# EAGLE design Double Socket_NoPowersch (EAGLE 7.4.0)
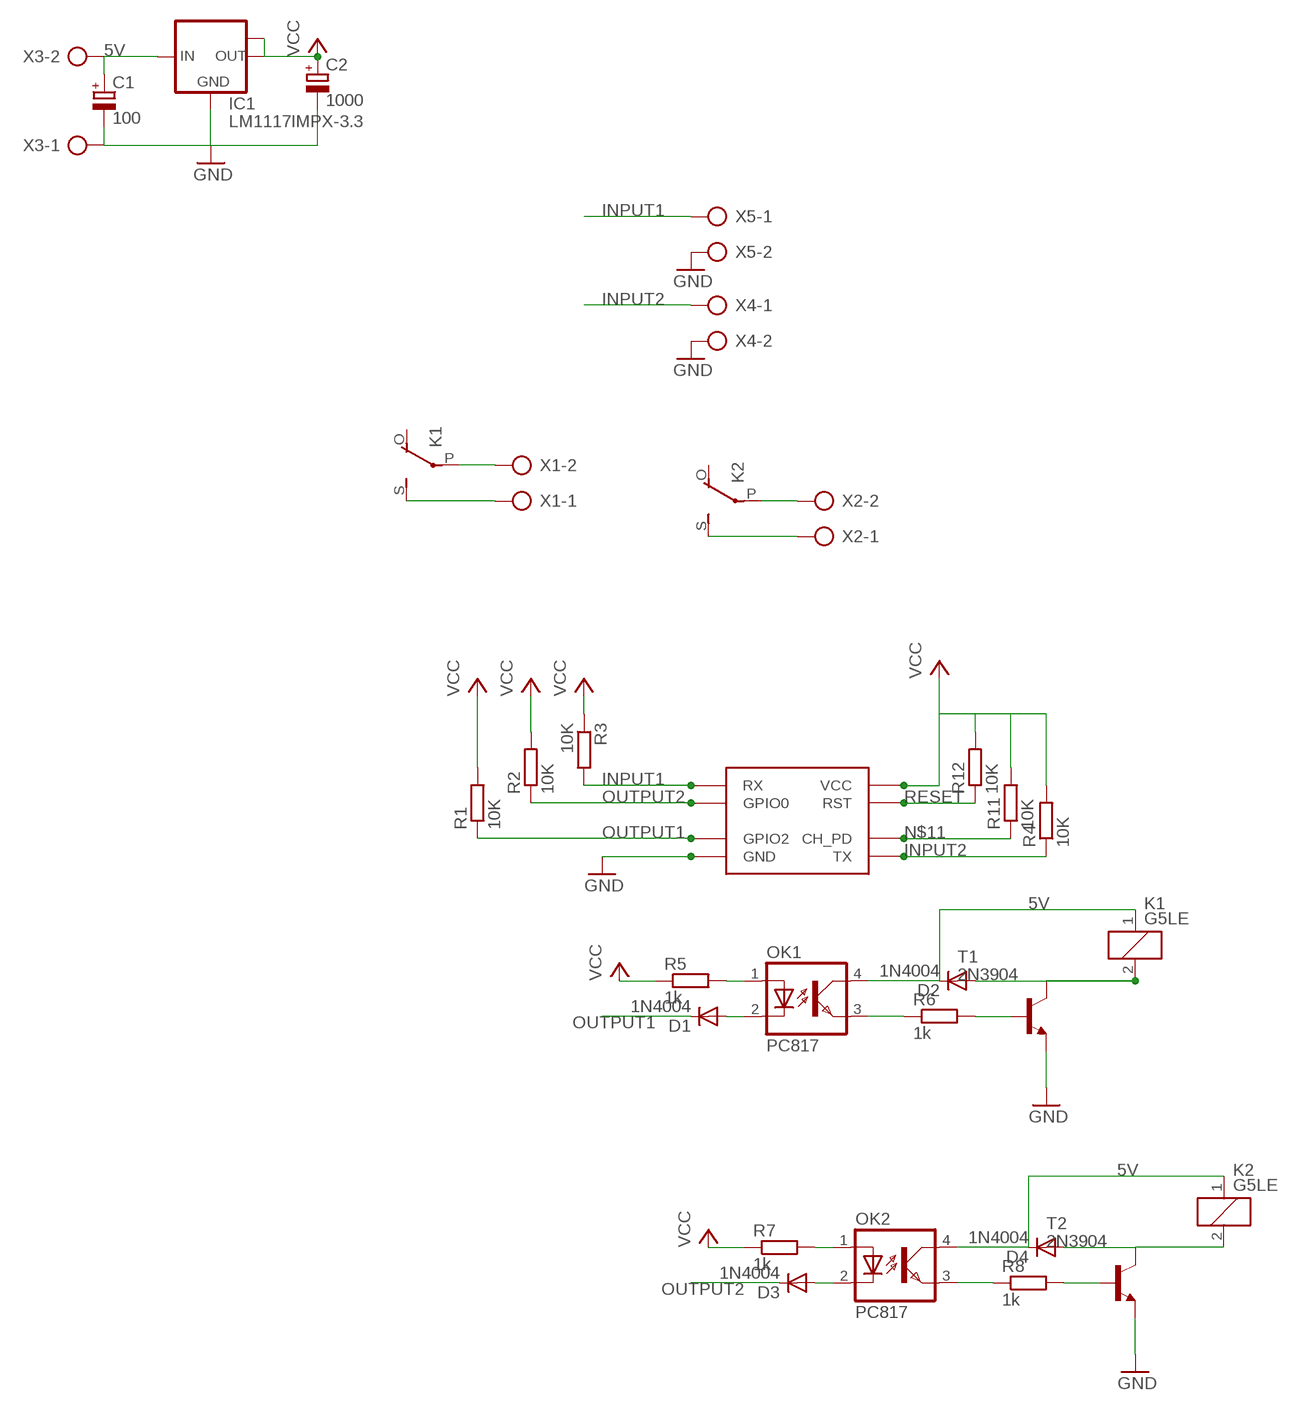
[diagram p0: schematic, sheet 1]

## Parts
C1  100  CPOL-EUE5-10.5  [E5-10,5]
C2  1000  CPOL-EUE5-10.5  [E5-10,5]
D1  1N4004  [DO41-10]
D2  1N4004  [DO41-10]
D3  1N4004  [DO41-10]
D4  1N4004  [DO41-10]
IC1  LM1117IMPX-3.3  [SOT223]
K1  G5LE  [G5LE]
K2  G5LE  [G5LE]
OK1  PC817  [DIL04]
OK2  PC817  [DIL04]
R1  10K  R-EU_0207/10  [0207/10]
R2  10K  R-EU_0207/10  [0207/10]
R3  10K  R-EU_0207/10  [0207/10]
R4  10K  R-EU_0207/10  [0207/10]
R5  1k  R-EU_0207/10  [0207/10]
R6  1k  R-EU_0207/10  [0207/10]
R7  1k  R-EU_0207/10  [0207/10]
R8  1k  R-EU_0207/10  [0207/10]
R11  10K  R-EU_0207/10  [0207/10]
R12  10K  R-EU_0207/10  [0207/10]
T1  2N3904  [TO92]
T2  2N3904  [TO92]
U$2  ESP8266  [ESP8266]
X1  AK500/2-H  [AK500/2-H]
X2  AK500/2-H  [AK500/2-H]
X3  AK500/2-H  [AK500/2-H]
X4  AK500/2-H  [AK500/2-H]
X5  AK500/2-H  [AK500/2-H]

## Nets
5V: C1.+ D2.C D4.C IC1.3(IN) K1.1 K2.1 OK1.4(COL) OK2.4(COL) X3.2
GND: C1.- C2.- IC1.1(GND) T1.3(E) T2.3(E) U$2.GND X3.1 X4.2 X5.2
INPUT1: R3.2 U$2.RX X5.1
INPUT2: R4.1 U$2.TX X4.1
N$1: K1.P(2:P) X1.2
N$2: K1.S(2:S) X1.1
N$3: OK1.1(A) R5.2
N$4: OK1.3(EMIT) R6.1
N$5: D1.A OK1.2(C)
N$6: OK2.1(A) R7.2
N$7: R6.2 T1.2(B)
N$8: D2.A K1.2 T1.1(C)
N$9: OK2.3(EMIT) R8.1
N$10: D3.A OK2.2(C)
N$11: R11.1 U$2.CH_PD
N$12: R8.2 T2.2(B)
N$13: D4.A K2.2 T2.1(C)
N$14: K2.S(2:S) X2.1
N$15: K2.P(2:P) X2.2
OUTPUT1: D1.C R1.1 U$2.GPIO2
OUTPUT2: D3.C R2.1 U$2.GPIO0
RESET: R12.1 U$2.RST
VCC: C2.+ IC1.2(OUT) IC1.TAB(OUT1) R1.2 R2.2 R3.1 R4.2 R5.1 R7.1 R11.2 R12.2 U$2.VCC
Unconnected: K1.O(2:O) K2.O(2:O)

## Library data of the parts
C1 C2 = rcl:CPOL-EU: POLARIZED CAPACITOR, European symbol
D1-D4 = diode:1N4004: DIODE general purpose rectifier, 1 A
IC1 = lm1117:LM1117IMPX-*
K1 K2 = relay:G5LE: RELAY 1 x switch, 10 A/120 V AC, 8 A/30 V DC, Omron; OC_FARNELL: unknown; OC_NEWARK: unknown
OK1 OK2 = optocoupler:PC817: SHARP OPTO COUPLER; MPN: PC817X4J000F; OC_FARNELL: 9707727; OC_NEWARK: 97K7059
R1-R8 R11 R12 = rcl:R-EU_: RESISTOR, European symbol
T1 T2 = transistor:2N3904: NPN TRANSISTOR
U$2 = Andre:ESP8266
X1-X5 = con-ptr500:AK500/2-H: CONNECTOR Aug. 2004 / PTR Meßtechnik: Die Bezeichnung der Serie AK505 wurde geändert. Es handelt sich hierbei um AK500 in horizontaler Ausführung.

## Board
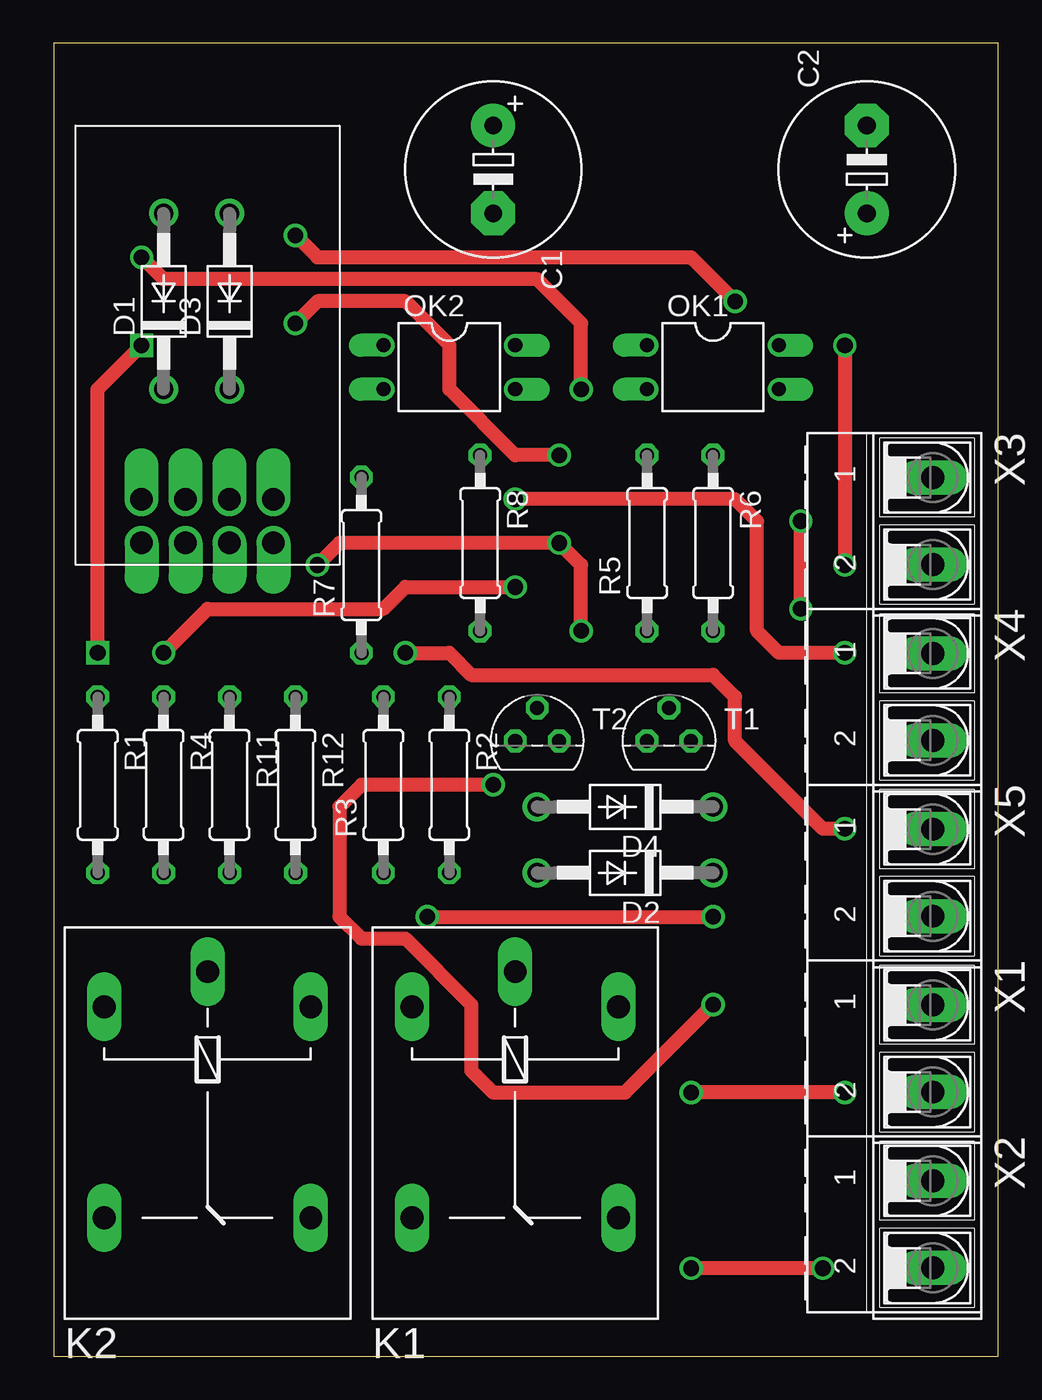
[diagram p1: board, top side]
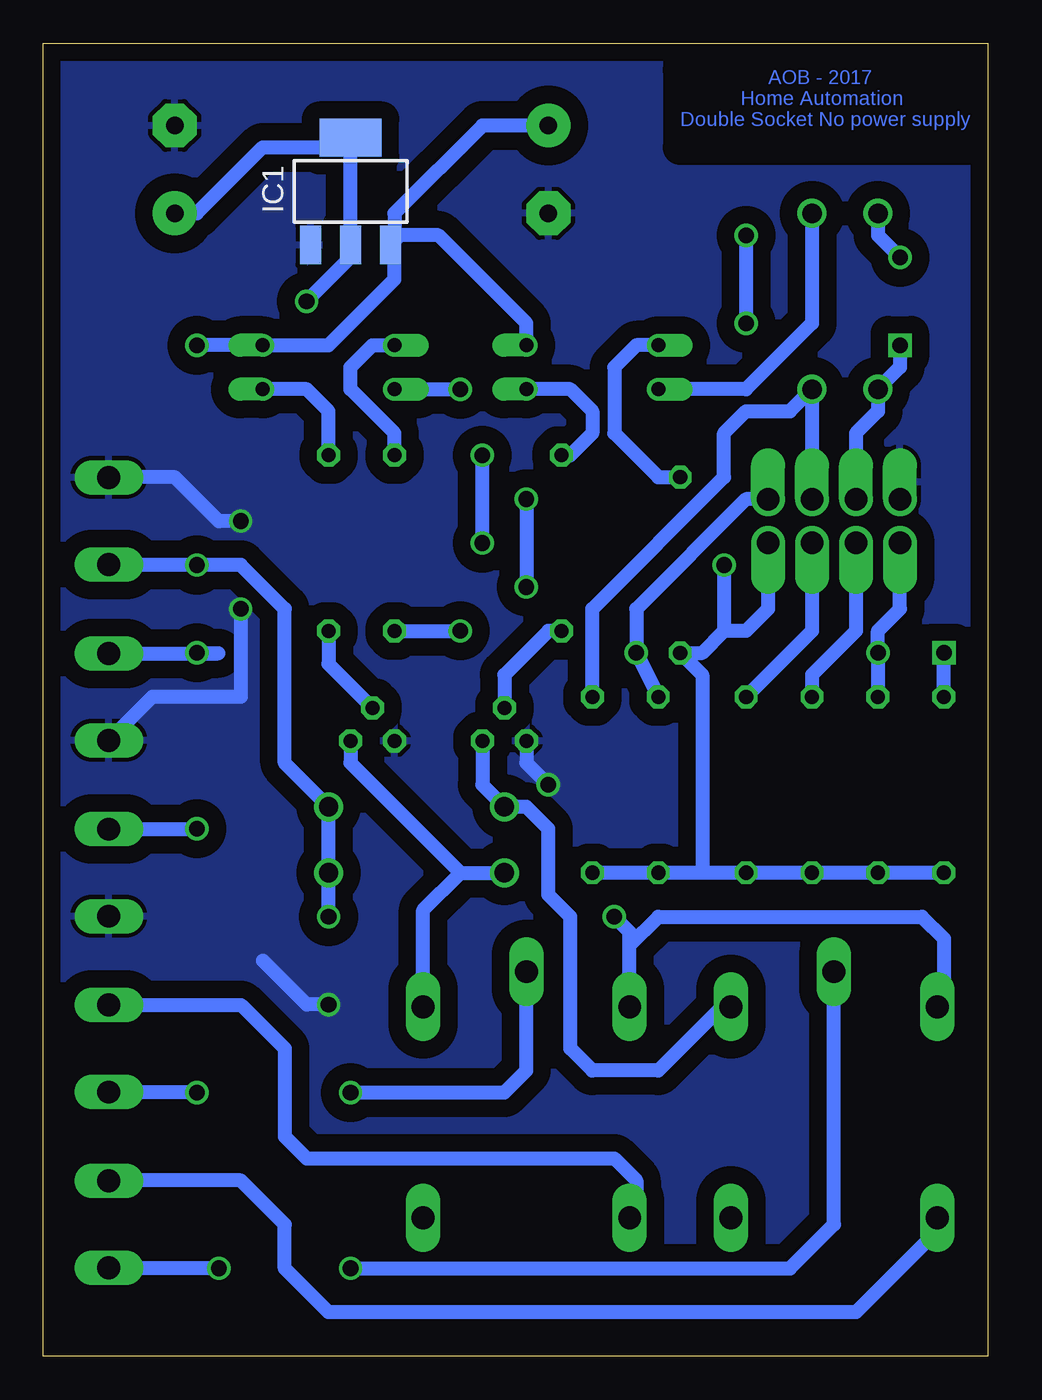
[diagram p2: board, bottom side, seen from below]

Size 54.59 x 75.87 mm. Coordinates in mm from the lower left corner, seen from the top.
Outline: 0,0 54.59,0 54.59,75.87 0,75.87 0,0
Copper layers (1*16): Top 0.035mm / dielectric 1.5mm / Bottom 0.035mm
Design rules "casa": minimum track width 10mil, minimum drill 24mil, track to track 12mil, track to pad 12mil, pad to pad 12mil, via to via 12mil, smd to smd 12mil, copper to edge 40mil, drill to drill 8mil, minimum pad ring 10mil, minimum via ring 8mil, stop-mask expansion 4mil, vias tented up to drill 0mil, thermal gap 10mil

### Footprints (pad centres in the part's own frame; a part is rotated, then mirrored left to right if it is on the bottom)
E5-10,5 = drill 1.016 pad 2.54: + -2.54,0 | drill 1.016 pad 2.54 octagon: - 2.54,0
DO41-10 = drill 1.118: A 5.08,0; C -5.08,0
SOT223 = smd 1.219 x 2.235: 1 -2.311,-3.099; 2 0,-3.099; 3 2.311,-3.099 | smd 3.6 x 2.2: TAB 0,3.099
G5LE = drill 1.321 long: 1 -7.493,-5.969; 2 -7.493,5.969; O 4.699,5.969; P -9.525,0; S 4.699,-5.969
DIL04 = drill 0.813 offset: 1 -1.27,-3.81; 2 1.27,-3.81; 3 1.27,3.81; 4 -1.27,3.81
0207/10 = drill 0.813 octagon: 1 -5.08,0; 2 5.08,0
TO92 = drill 0.813 octagon: 1 1.27,0; 2 0,1.905; 3 -1.27,0
ESP8266 = drill 1.3 offset: CH_PD -1.27,-11.43; GND -3.81,-8.89; GPIO0 1.27,-8.89; GPIO2 -1.27,-8.89; RST 1.27,-11.43; RX 3.81,-8.89; TX -3.81,-11.43; VCC 3.81,-11.43
AK500/2-H = drill 1.321 long: 1 -2.515,0; 2 2.515,0

### Placement (x,y rotation side)
C1  25.4,68.58 270 top
C2  46.99,68.58 90 top
D1  6.35,60.96 90 top
D2  33.02,27.94 180 top
D3  10.16,60.96 90 top
D4  33.02,31.75 180 top
IC1  36.83,67.31 0 bottom
K1  26.67,12.7 270 top
K2  8.89,12.7 270 top
OK1  38.1,57.15 270 top
OK2  22.86,57.15 270 top
R1  2.54,33.02 270 top
R2  22.86,33.02 270 top
R3  19.05,33.02 90 top
R4  6.35,33.02 270 top
R5  34.29,46.99 90 top
R6  38.1,46.99 270 top
R7  17.78,45.72 90 top
R8  24.64,46.99 270 top
R11  10.16,33.02 270 top
R12  13.97,33.02 270 top
T1  35.56,35.56 0 top
T2  27.94,35.56 0 top
U$2  8.89,58.42 0 top
X1  50.8,17.78 270 top
X2  50.8,7.62 270 top
X3  50.8,48.26 270 top
X4  50.8,38.1 270 top
X5  50.8,27.94 270 top

### Tracks (layer width: path | path; a pad name or v marks a point on that pad's centre or on a via)
5V  (via drill 0.9)
  Top 0.813: v21.59,25.4 v38.1,25.4 | v45.72,58.42 v45.72,45.72
  Bottom 0.813: C1.+ 29.21,71.12 34.29,66.04 34.29,64.44 IC1.3 | OK2.4 26.67,59.69 31.75,64.77 33.96,64.77 IC1.3 | K1.1 20.7,23.75 | 20.7,23.75 19.05,25.4 3.81,25.4 2.54,24.13 2.54,20.57 K2.1 | 20.7,23.75 20.7,24.51 v21.59,25.4 | v38.1,25.4 D2.C D4.C 40.64,34.29 40.64,43.18 43.18,45.72 v45.72,45.72 50.77,45.72 X3.2 | IC1.3 34.29,63.98 34.29,62.23 38.1,58.42 OK1.4 v45.72,58.42
GND  (via drill 0.9)
  Top 0.813: v43.18,43.18 v43.18,48.26 | v25.4,33.02 17.78,33.02 16.51,31.75 16.51,25.4 17.78,24.13 20.32,24.13 24.13,20.32 24.13,16.51 25.4,15.24 33.02,15.24 v38.1,20.32
  Bottom 0.813: v43.18,48.26 44.45,48.26 46.99,50.8 50.77,50.8 X3.1 | v43.18,43.18 43.18,38.1 48.28,38.1 X4.2 | T2.3 26.67,34.29 v25.4,33.02 | v38.1,20.32 39.37,20.32 41.91,22.86
  pour Bottom (isolate 1.016): 0,0 54.61,0 54.61,76.2 0,76.2
INPUT1  (via drill 0.9)
  Top 0.813: v45.72,30.48 44.45,30.48 39.37,35.56 39.37,38.1 38.1,39.37 24.13,39.37 22.86,40.64 v20.32,40.64
  Bottom 0.813: X5.1 45.74,30.45 v45.72,30.48 | R3.2 v20.32,40.64 20.32,43.18 13.97,49.53 U$2.RX
INPUT2  (via drill 0.9)
  Top 0.813: v26.67,49.53 39.37,49.53 40.64,48.26 40.64,41.91 41.91,40.64 v45.72,40.64 | v6.35,40.64 8.89,43.18 19.05,43.18 20.32,44.45 v26.67,44.45
  Bottom 0.813: U$2.TX 5.08,43.18 6.35,41.91 v6.35,40.64 R4.1 | X4.1 44.48,40.62 v45.72,40.64 | v26.67,49.53 v26.67,44.45
N$1  (via drill 0.9)
  Top 0.813: v45.72,15.24 v36.83,15.24
  Bottom 0.813: X1.2 45.74,15.27 v45.72,15.24 | v36.83,15.24 27.94,15.24 26.67,16.51 K1.P
N$2
  Bottom 0.813: X1.1 43.16,20.3 40.64,17.78 40.64,12.7 39.37,11.43 21.59,11.43 20.32,10.16 20.32,8.38 K1.S
N$3
  Bottom 0.813: R5.2 34.29,53.34 36.83,55.88 36.83,57.15 35.56,58.42 OK1.1
N$4
  Bottom 0.813: R6.1 38.1,54.61 39.37,55.88 OK1.3
N$5  (via drill 0.9)
  Top 0.813: v30.48,55.88 30.48,59.69 27.94,62.23 6.35,62.23 v5.08,63.5
  Bottom 0.813: OK1.2 v30.48,55.88 | D1.A 6.35,64.77 v5.08,63.5
N$6
  Bottom 0.813: OK2.1 20.32,58.42 21.59,57.15 21.59,53.34 19.05,50.8 R7.2
N$7
  Bottom 0.813: R6.2 38.1,40.01 T1.2
N$8
  Bottom 0.813: K1.2 32.64,25.78 30.48,27.94 | 30.48,27.94 D2.A | T1.1 36.83,34.29 30.48,27.94
N$9
  Bottom 0.813: OK2.3 24.13,55.88 22.86,54.61 22.86,53.34 24.13,52.07 R8.1
N$10
  Bottom 0.813: D3.A 10.16,59.69 13.97,55.88 OK2.2
N$11
  Bottom 0.813: U$2.CH_PD 7.62,41.91 10.16,39.37 R11.1
N$12
  Bottom 0.813: R8.2 25.4,41.91 27.94,39.37 T2.2
N$13
  Bottom 0.813: K2.2 15.37,20.19 19.05,16.51 22.86,16.51 24.13,17.78 24.13,25.4 25.4,26.67 25.4,30.48 26.67,31.75 D4.A 29.21,33.02 T2.1
N$14
  Bottom 0.813: K2.S 2.92,7.24 7.62,2.54 38.1,2.54 40.64,5.08 40.64,7.62 43.18,10.16 50.77,10.16 X2.1
N$15  (via drill 0.9)
  Top 0.813: v44.45,5.08 v36.83,5.08
  Bottom 0.813: X2.2 44.48,5.11 v44.45,5.08 | v36.83,5.08 11.43,5.08 8.89,7.62 K2.P
OUTPUT1  (via drill 0.9)
  Top 0.813: v2.54,40.64 2.54,55.88 v5.08,58.42
  Bottom 0.813: U$2.GPIO2 7.62,53.34 6.35,54.61 D1.C 5.08,57.15 v5.08,58.42 | R1.1 v2.54,40.64
OUTPUT2
  Bottom 0.813: U$2.GPIO0 D3.C 11.43,54.61 13.97,54.61 15.24,53.34 15.24,50.8 22.86,43.18 R2.1
RESET
  Bottom 0.813: U$2.RST 10.16,41.91 R12.1
VCC  (via drill 0.9)
  Top 0.813: v30.48,41.91 30.48,45.72 v29.21,46.99 16.51,46.99 v15.24,45.72 | v29.21,52.07 26.67,52.07 22.86,55.88 22.86,58.42 20.32,60.96 15.24,60.96 v13.97,59.69 | v39.37,60.96 36.83,63.5 15.24,63.5 v13.97,64.77
  Bottom 0.813: R1.2 R4.2 R11.2 R12.2 16.51,27.94 | 16.51,27.94 R3.1 R2.2 | 36.83,69.85 IC1.2 36.83,63.5 v39.37,60.96 | 36.83,69.85 IC1.TAB | U$2.VCC 12.7,43.18 13.97,41.91 15.24,41.91 | C2.+ 45.72,66.04 41.91,69.85 36.83,69.85 | R5.1 v30.48,41.91 | v15.24,45.72 15.24,41.91 | v29.21,46.99 v29.21,52.07 | v13.97,64.77 v13.97,59.69 | 16.51,27.94 16.51,39.37 R7.1 16.51,40.64 15.24,41.91

### Text on the board
Bottom: AOB - 2017 / Home Automation / Double Socket No power supply